# EAGLE design PlantDuino_v2_0 (EAGLE 6.5.0)
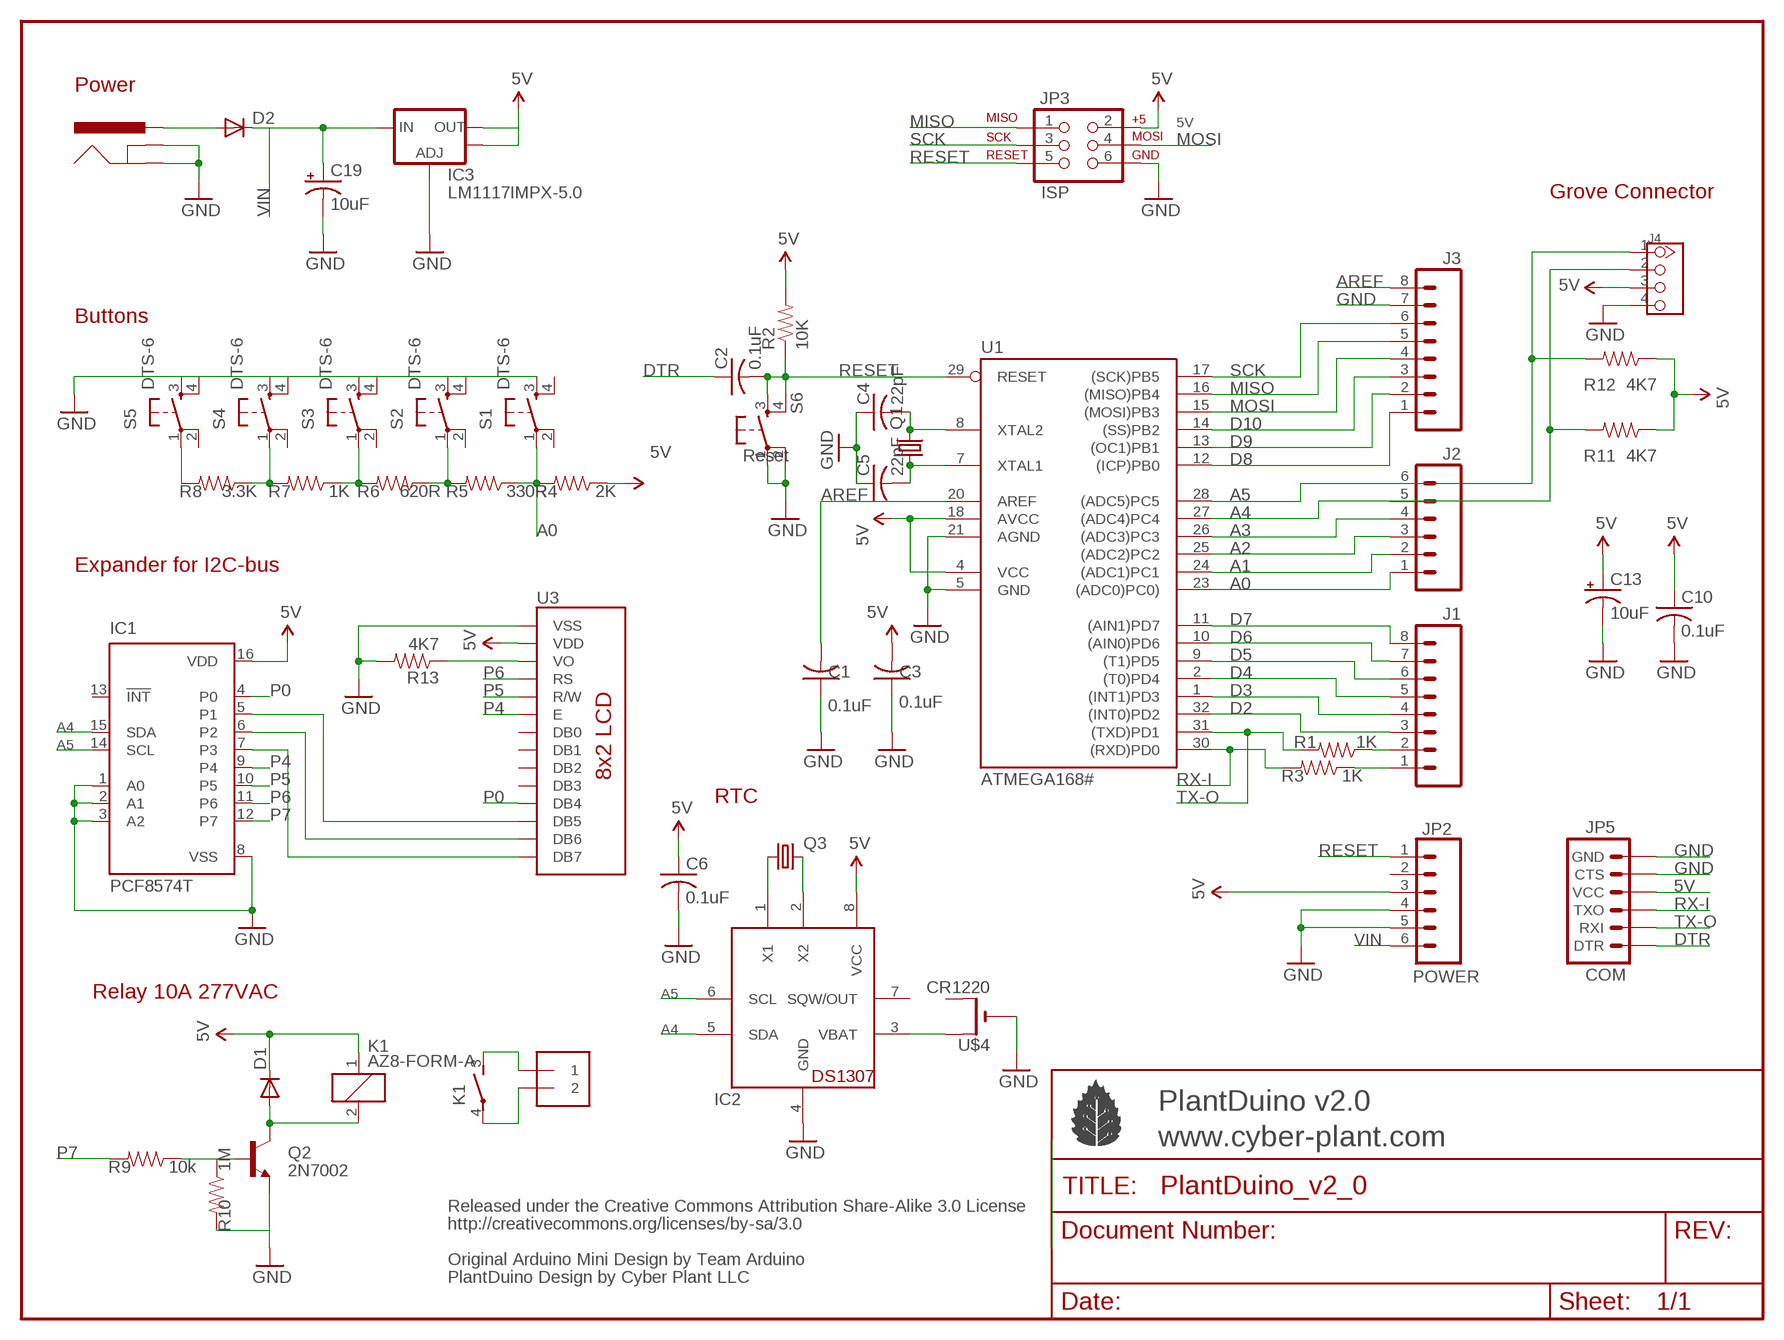
[diagram p0: schematic, sheet 1]

## Parts
C1  0.1uF  C-USC1206  [C1206]
C2  0.1uF  C-USC1206  [C1206]
C3  0.1uF  C-USC1206  [C1206]
C4  22pF  C-USC1206  [C1206]
C5  22pF  C-USC1206  [C1206]
C6  0.1uF  C-USC1206  [C1206]
C10  0.1uF  C-USC1206  [C1206]
C13  10uF  CAP_POL6032  [EIA6032]
C19  10uF  CAP_POL6032  [EIA6032]
D1  DIODESMA  [SMA-DIODE]
D2  DIODESMA  [SMA-DIODE]
IC1  PCF8574T  [SO16W]
IC2  DS1307  [SO08]
IC3  LM1117IMPX-5.0  V_REG_LM1117SOT223  [SOT223]
J1  M08LONGPADS  [1X08_LONGPADS]
J2  M06LONGPADS  [1X06_LONGPADS]
J3  M08LONGPADS  [1X08_LONGPADS]
J4  TWIG-4P-2.090D  [4P-2.0-90D]
JP1  1X2-3.5MM  [1X2-3.5MM]
JP2  POWER  M06LONGPADS  [1X06_LONGPADS]
JP3  ISP  AVR_SPI_PRG_6PTH  [2X3]
JP4  Power Jack  POWER_JACKPTH  [POWER_JACK_PTH]
JP5  COM  ARDUINO_SERIAL_PROGRAMPTH  [1X06]
K1  AZ8-FORM-A  [AZ8]
Q1  CRYTALHC49S  [HC49/S@1]
Q2  2N7002  TRANSISTOR_NPNSOT23  [SOT23]
Q3  CRYSTALTC26H  [TC26H]
R1  1K  RESISTOR1206  [1206]
R2  10K  RESISTOR1206  [1206]
R3  1K  RESISTOR1206  [1206]
R4  2K  RESISTOR1206  [1206]
R5  330R  RESISTOR1206  [1206]
R6  620R  RESISTOR1206  [1206]
R7  1K  RESISTOR1206  [1206]
R8  3.3K  RESISTOR1206  [1206]
R9  10k  RESISTOR1206  [1206]
R10  1M  RESISTOR1206  [1206]
R11  4K7  RESISTOR1206  [1206]
R12  4K7  RESISTOR1206  [1206]
R13  4K7  RESISTOR1206  [1206]
S1  DTS-6  [DTS-6]
S2  DTS-6  [DTS-6]
S3  DTS-6  [DTS-6]
S4  DTS-6  [DTS-6]
S5  DTS-6  [DTS-6]
S6  Reset  DTS-6  [DTS-6]
U1  ATMEGA168#  AT90S4433A  [TQFP32-08]
U3  LCD-8X2-WH0802A8X2  [LCD-8X2-WH0802A]
U$4  CR1220  CR1220THM  [CR1220-THM]

## Nets
5V: C3.2 C6.1 C10.1 C13.P$1(+) D1.C IC1.16(VDD) IC2.8(VCC) IC3.2(OUT) IC3.4(OUT) J4.3 JP2.3 JP3.2 JP5.4(VCC) K1.1 R2.2 R4.1 R11.1 R12.1 U1.4(VCC) U1.18(AVCC) U3.2(VDD)
A0: J2.1 R4.2 R5.1 S1.1 U1.23((ADC0)PC0))
A1: J2.2 U1.24((ADC1)PC1)
A2: J2.3 U1.25((ADC2)PC2)
A3: J2.4 U1.26((ADC3)PC3)
A4: IC1.15(SDA) IC2.5(SDA) J2.5 J4.2 R11.2 U1.27((ADC4)PC4)
A5: IC1.14(SCL) IC2.6(SCL) J2.6 J4.1 R12.2 U1.28((ADC5)PC5)
AREF: C1.2 J3.8 U1.20(AREF)
D2: J1.3 U1.32((INT0)PD2)
D3: J1.4 U1.1((INT1)PD3)
D4: J1.5 U1.2((T0)PD4)
D5: J1.6 U1.9((T1)PD5)
D6: J1.7 U1.10((AIN0)PD6)
D7: J1.8 U1.11((AIN1)PD7)
D8: J3.1 U1.12((ICP)PB0)
D9: J3.2 U1.13((OC1)PB1)
D10: J3.3 U1.14((SS)PB2)
DTR: C2.1 JP5.1(DTR)
GND [vcc]: C1.1 C3.1 C4.1 C5.1 C6.2 C10.2 C13.P$2(-) C19.P$2(-) IC1.1(A0) IC1.2(A1) IC1.3(A2) IC1.8(VSS) IC2.4(GND) IC3.1(ADJ) J3.7 J4.4 JP2.4 JP2.5 JP3.6 JP4.GND JP4.GNDBREAK JP5.5(CTS) JP5.6(GND) Q2.2(E) R10.2 R13.2 S1.3 S2.3 S2.4 S3.3 S3.4 S4.3 S4.4 S5.3 S5.4 S6.1 S6.2 U1.5(GND) U1.21(AGND) U3.1(VSS) U$4.-
MISO: J3.5 JP3.1 U1.16((MISO)PB4)
MOSI: J3.4 JP3.4 U1.15((MOSI)PB3)
N$1: R13.1 U3.3(VO)
N$3: C4.2 Q1.2 U1.8(XTAL2)
N$4: C5.2 Q1.1 U1.7(XTAL1)
N$6: D2.A JP4.PWR
N$8: IC1.7(P3) U3.14(DB7)
N$9: IC1.6(P2) U3.13(DB6)
N$10: IC1.5(P1) U3.12(DB5)
N$12: IC2.3(VBAT) U$4.+1(+)
N$14: JP1.2 K1.4(-1:P)
N$15: JP1.1 K1.3(-1:S)
N$16: Q2.1(B) R9.1 R10.1
N$17: R5.2 R6.1 S2.1
N$18: R6.2 R7.1 S3.1
N$19: R7.2 R8.1 S4.1
N$20: R8.2 S5.1
N$21: IC2.1(X1) Q3.1
N$22: D1.A K1.2 Q2.3(C)
N$24: IC2.2(X2) Q3.2
P0: IC1.4(P0) U3.11(DB4)
P4: IC1.9(P4) U3.6(E)
P5: IC1.10(P5) U3.5(R/W)
P6: IC1.11(P6) U3.4(RS)
P7: IC1.12(P7) R9.2
RESET: C2.2 JP2.1 JP3.5 R2.1 S6.3 S6.4 U1.29(RESET)
RX-I: JP5.3(TXO) R3.2 U1.30((RXD)PD0)
RX-IP: J1.2 R1.1
SCK: J3.6 JP3.3 U1.17((SCK)PB5)
TX-O: JP5.2(RXI) R1.2 U1.31((TXD)PD1)
TX-OP: J1.1 R3.1
VIN [vcc]: C19.P$1(+) D2.C IC3.3(IN) JP2.6
Unconnected: IC1.13(!INT) IC2.7(SQW/OUT) JP2.2 S1.2 S1.4 S2.2 S3.2 S4.2 S5.2 U3.7(DB0) U3.8(DB1) U3.9(DB2) U3.10(DB3) U$4.+2(+1)

## Notes on the sheet
- Power
- Grove Connector
- Buttons
- Expander for I2C-bus
- RTC
- Relay 10A 277VAC
- PlantDuino v2.0
- www.cyber-plant.com
- Released under the Creative Commons Attribution Share-Alike 3.0 License
- http://creativecommons.org/licenses/by-sa/3.0
- Original Arduino Mini Design by Team Arduino
- PlantDuino Design by Cyber Plant LLC

## Library data of the parts
C1-C6 C10 = adafruit:C-US: CAPACITOR, American symbol
C13 C19 = SparkFun:CAP_POL: Capacitor Polarized These are standard SMD and PTH capacitors. Normally 10uF, 47uF, and 100uF in electrolytic and tantalum varieties. Always verify the external diameter of the through hole cap, it varies with capacity, voltage, and manufacturer. The EIA devices should be standard.
D1 D2 = SparkFun:DIODE: Diode These are standard reverse protection diodes and small signal diodes. SMA package can handle up to about 1A. SOD-323 can handle about 200mA. What the SOD-323 package when ordering, there are some mfgs out there that are 5-pin packages.
IC1 = micro-philips:PCF8574: I2C-Bus Remote 8-bit I/O expander http://www.semiconductors.philips.com/acrobat_download/datasheets/PCF8574_4.pdf; MPN: PCF8574T/3,512; OC_FARNELL: 1201255; OC_NEWARK: 70R6870
IC2 = adafruit_ds1307soic8:DS1307: DS1307 Real time clock (RTC) with battery backup ability. Talk to it via i2c
IC3 = SparkFun:V_REG_LM1117: Voltage Regulator LM1117 Standard adjustable voltage regulator but in SMD form. Spark Fun Electronics SKU : COM-00595
J1 J3 = Head_my:M08: Header 8 Standard 8-pin 0.1" header. Use with straight break away headers (SKU : PRT-00116), right angle break away headers (PRT-00553), swiss pins (PRT-00743), machine pins (PRT-00117), and female headers (PRT-00115).
J2 JP2 = Head_my:M06: Header 6 Standard 6-pin 0.1" header. Use with straight break away headers (SKU : PRT-00116), right angle break away headers (PRT-00553), swiss pins (PRT-00743), machine pins (PRT-00117), and female headers (PRT-00115). Molex polarized connector foot print use with SKU : PRT-08094 with associated crimp pins and housings. NOTES ON THE VARIANTS LOCK and LOCK_LONGPADS... This footprint was designed to help hold the alignment of a through-hole component (i.e. 6-pin header) while soldering it into place. You may notice that each hole has been shifted either up or down by 0.005 of an inch from it's more standard position (which is a perfectly straight line). This slight alteration caused the pins (the squares in the middle) to touch the edges of the holes. Because they are alternating, it causes a "brace" to hold the component in place. 0.005 has proven to be the perfect amount of "off-center" position when using our standard breakaway headers. Although looks a little odd when you look at the bare footprint, once you have a header in there, the alteration is very hard to notice. Also, if you push a header all the way into place, it is covered up entirely on the bottom side. This idea of altering the position of holes to aid alignment will be further integrated into the Sparkfun Library for other footprints. It can help hold any component with 3 or more connection pins.
J4 = Connector:TWIG-4P-2.0
JP1 = adafruit:1X2: 3.5mm Terminal block http://www.ladyada.net/library/pcb/eaglelibrary.html
JP3 = SparkFun:AVR_SPI_PRG_6: AVR ISP 6 Pin This is the reduced ISP connector for AVR programming. Common on Arduino. This footprint will take up less PCB space and can be used with a 10-pin to 6-pin adapter such as SKU: BOB-08508
JP4 = SparkFun:POWER_JACK: Power Jack This is the standard 5.5mm barrel jack for power. The PTH is the most common, proven, reliable, footprint. All others are experimental. The Slot footprint only works if the mill layer is transmitted to the PCB fab house so be warned. Spark Fun Electronics SKU : PRT-00119. Mating wall wart : TOL-00298 (and others)
JP5 = SparkFun:ARDUINO_SERIAL_PROGRAM
K1 = relay_my:AZ8-FORM-A: MINIATURE PC BOARD RELAY Form A Source: www.azettler.com .. AZ8-1ch-12DSE.PDF; OC_FARNELL: unknown; OC_NEWARK: unknown
Q1 = crystal:CRYTAL: CRYSTAL
Q2 = SparkFun:TRANSISTOR_NPN: Transistor NPN BJT configuration in SOT23 package. MMBT2222 is the common NPN we use. Double check BCE configuration again layout.
Q3 = crystal:CRYSTAL: CRYSTAL; OC_FARNELL: unknown; OC_NEWARK: unknown
R1-R13 = SparkFun:RESISTOR: Resistor Basic schematic elements and footprints for 0603, 1206, and PTH resistors.
S1-S6 = switch-tact:DTS-6
U1 = atmel:AT90S4433: MICROCONTROLLER 4 Kbytes FLASH 128 bytes SRAM 256 bytes EEPROM UART 6-channel 10 bit ADC
U3 = wh0802a3:LCD-8X2-WH0802A
U$4 = adafruit_ch23-1220lf:CR1220: CR1216/CR1220/CR1225 12mm 3V lithium coin cell Great for battery packup. Both SMT and THM holders. Note the THM package has the ground pads on both sides of the PCB so that the masks are the same - this reduces the cost

## Net classes
0 default: width 0.203 mm
1 vcc: width 0.254 mm

## Board
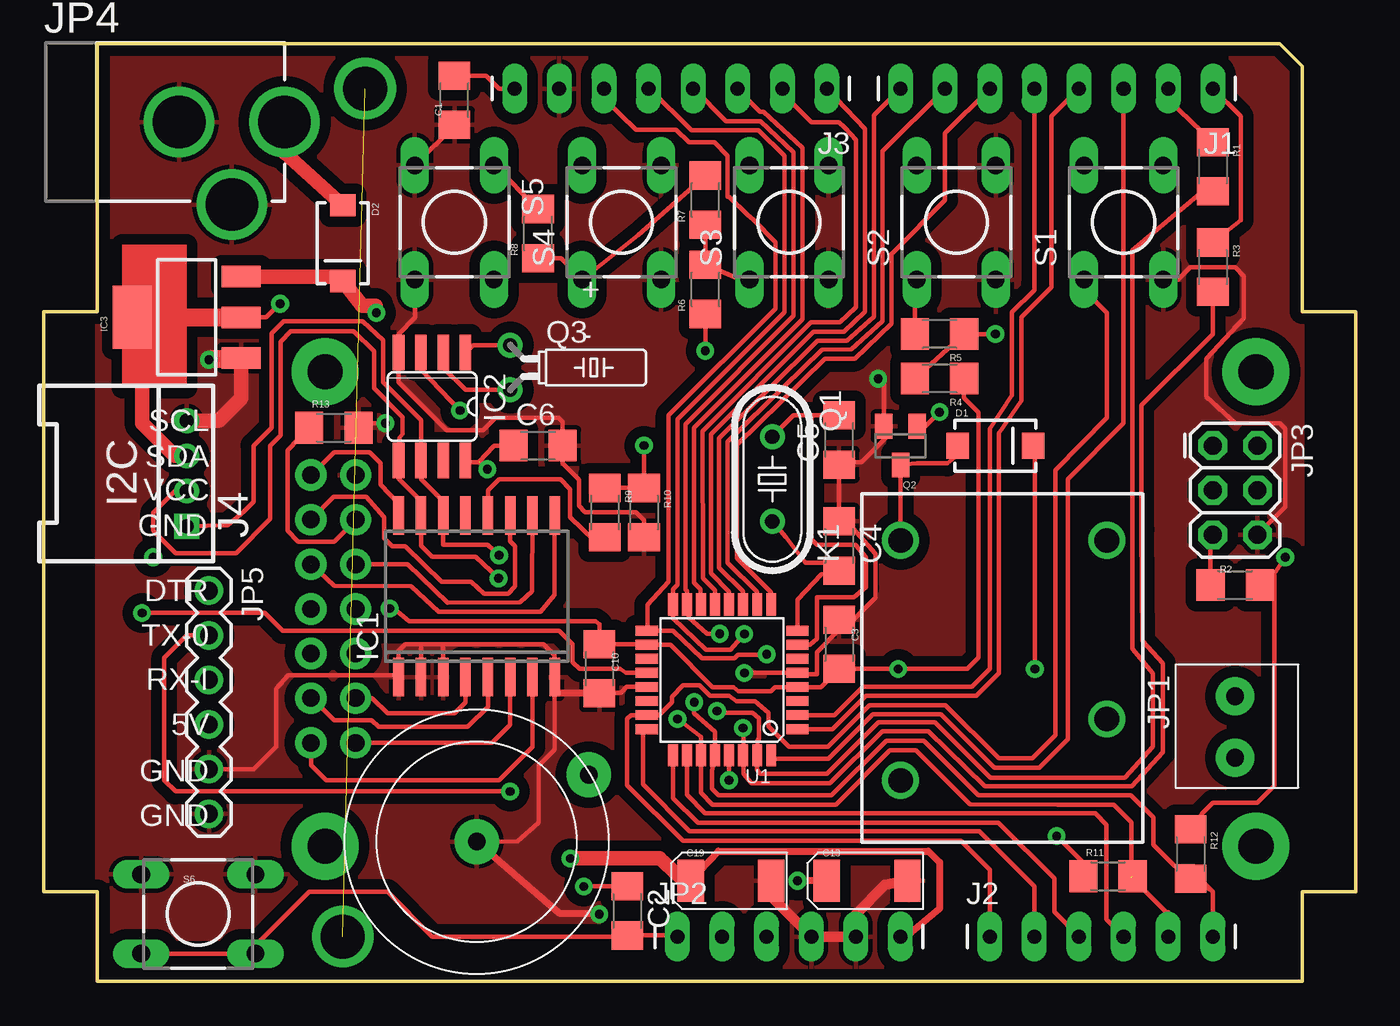
[diagram p1: board, top side]
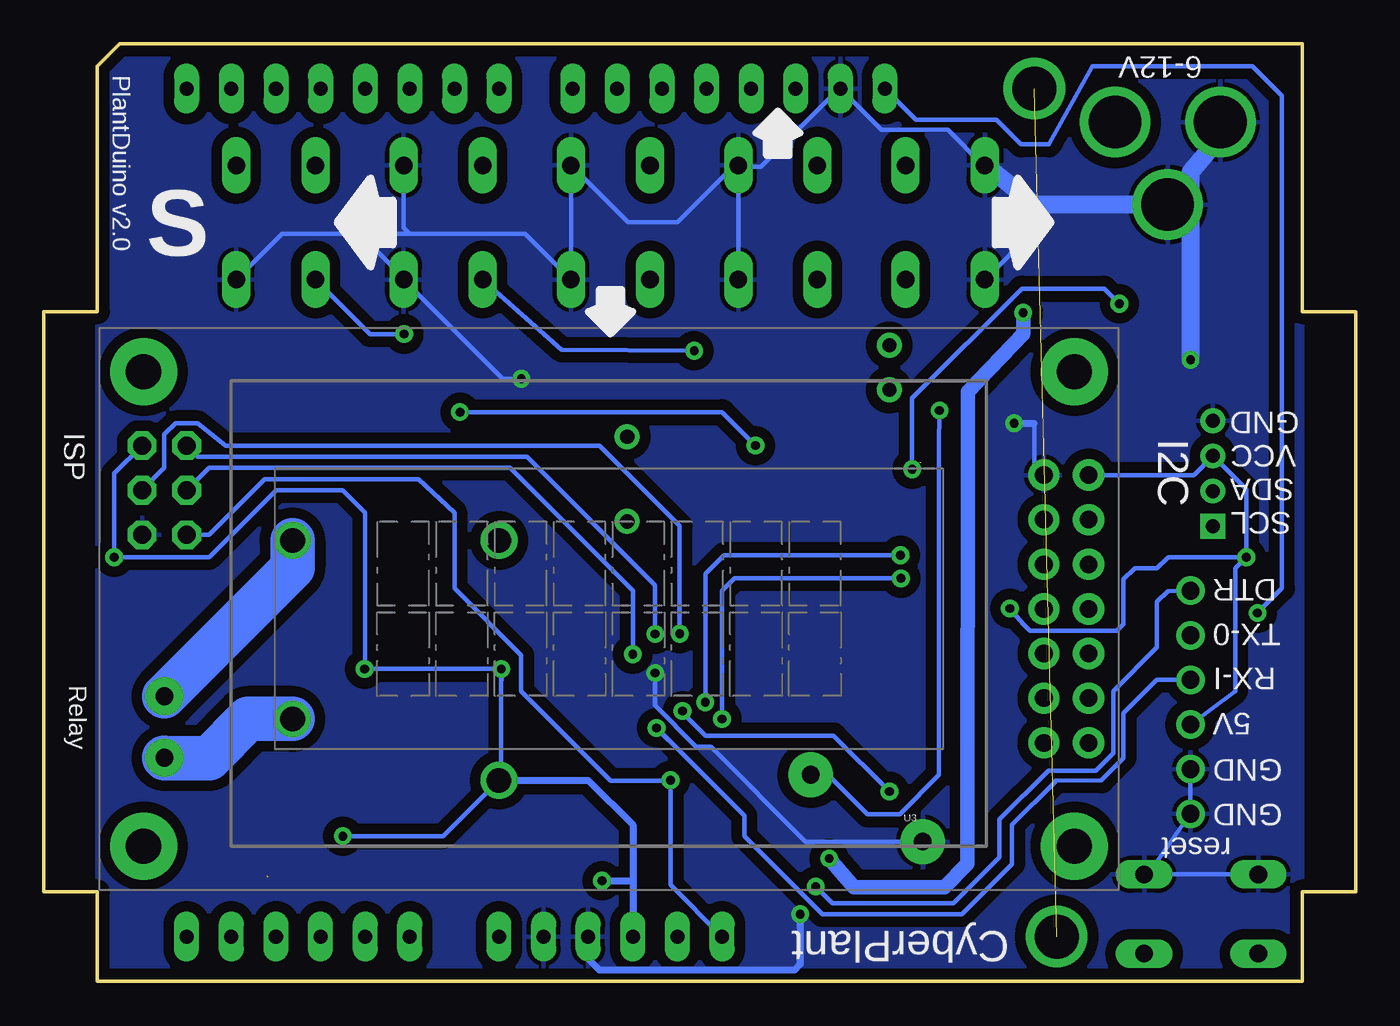
[diagram p2: board, bottom side, seen from below]

Size 74.68 x 53.34 mm. Coordinates in mm from the lower left corner, seen from the top.
Outline: 3.05,53.34 3.05,38.1 0,38.1 0,5.08 3.05,5.08 3.05,0 71.63,0 71.63,5.08 74.68,5.08 74.68,38.1 71.63,38.1 71.63,52.07 70.36,53.34 3.05,53.34
Copper layers (1*16): Top 0.035mm / dielectric 1.5mm / Bottom 0.035mm
Design rules "SparkFun *": minimum track width 8mil, minimum drill 20mil, track to track 10mil, track to pad 10mil, pad to pad 10mil, via to via 10mil, smd to smd 10mil, copper to edge 10mil, drill to drill 8mil, minimum pad ring 12mil, minimum via ring 10mil, stop-mask expansion 4mil, vias tented up to drill 20mil, thermal gap 10mil

### Footprints (pad centres in the part's own frame; a part is rotated, then mirrored left to right if it is on the bottom)
C1206 = smd 1.6 x 1.8: 1 -1.4,0; 2 1.4,0
EIA6032 = smd 1.5 x 2.4: P$1 -2.3,0; P$2 2.3,0
SMA-DIODE = smd 1.27 x 1.47: A -2.15,0; C 2.15,0
SO16W = smd 0.6 x 2.2: 1 -4.445,-4.6; 2 -3.175,-4.6; 3 -1.905,-4.6; 4 -0.635,-4.6; 5 0.635,-4.6; 6 1.905,-4.6; 7 3.175,-4.6; 8 4.445,-4.6; 9 4.445,4.6; 10 3.175,4.6; 11 1.905,4.6; 12 0.635,4.6; 13 -0.635,4.6; 14 -1.905,4.6; 15 -3.175,4.6; 16 -4.445,4.6
SO08 = smd 0.66 x 2.032: 1 -1.905,-3.073; 2 -0.635,-3.073; 3 0.635,-3.073; 4 1.905,-3.073; 5 1.905,3.073; 6 0.635,3.073; 7 -0.635,3.073; 8 -1.905,3.073
SOT223 = smd 1.219 x 2.235: 1 -2.311,-3.099; 2 0,-3.099; 3 2.311,-3.099 | smd 3.6 x 2.2: 4 0,3.099
1X08_LONGPADS = drill 0.8 pad 1.422 long: 1 0,0; 2 2.54,0; 3 5.08,0; 4 7.62,0; 5 10.16,0; 6 12.7,0; 7 15.24,0; 8 17.78,0
1X06_LONGPADS = drill 0.8 pad 1.422 long: 1 0,0; 2 2.54,0; 3 5.08,0; 4 7.62,0; 5 10.16,0; 6 12.7,0
4P-2.0-90D = drill 0.8 pad 1.27 square: 1 -3,0 | drill 0.8 pad 1.27: 2 -1,0; 3 1,0; 4 3,0
1X2-3.5MM = drill 1 pad 2.184: 1 1.8,0; 2 -1.7,0
2X3 = drill 1.016 octagon: 1 0,0; 2 0,2.54; 3 2.54,0; 4 2.54,2.54; 5 5.08,0; 6 5.08,2.54
POWER_JACK_PTH = drill 2.997: GND 0,7.7; GNDBREAK 4.7,10.7; PWR 0,13.7
1X06 = drill 1.016: 1 0,0; 2 2.54,0; 3 5.08,0; 4 7.62,0; 5 10.16,0; 6 12.7,0
AZ8 = drill 1.4 pad 2: 1 4.445,-5.397; 2 -9.207,-5.397; 3 -9.207,6.35; 4 0.953,6.35; 5 0.953,6.35
HC49/S@1 = drill 0.813: 1 -2.413,0; 2 2.413,0
SOT23 = smd 1 x 1.4: 1 -0.95,-1.1; 2 0.95,-1.1; 3 0,1.1
TC26H = drill 0.813: 1 -1.27,0; 2 1.27,0
1206 = smd 1.6 x 1.8: 1 -1.4,0; 2 1.4,0
DTS-6 = drill 1 long: 1 -3.25,2.25; 2 3.25,2.25; 3 -3.25,-2.25; 4 3.25,-2.25
TQFP32-08 = smd 1.27 x 0.559: 1 -4.293,2.8; 2 -4.293,2; 3 -4.293,1.2; 4 -4.293,0.4; 5 -4.293,-0.4; 6 -4.293,-1.2; 7 -4.293,-2; 8 -4.293,-2.8; 17 4.293,-2.8; 18 4.293,-2; 19 4.293,-1.2; 20 4.293,-0.4; 21 4.293,0.4; 22 4.293,1.2; 23 4.293,2; 24 4.293,2.8 | smd 0.559 x 1.27: 9 -2.8,-4.293; 10 -2,-4.293; 11 -1.2,-4.293; 12 -0.4,-4.293; 13 0.4,-4.293; 14 1.2,-4.293; 15 2,-4.293; 16 2.8,-4.293; 25 2.8,4.293; 26 2,4.293; 27 1.2,4.293; 28 0.4,4.293; 29 -0.4,4.293; 30 -1.2,4.293; 31 -2,4.293; 32 -2.8,4.293
LCD-8X2-WH0802A = drill 1 pad 1.778: 1 -26.26,-9.12; 2 -28.8,-9.12; 3 -26.26,-6.58; 4 -28.8,-6.58; 5 -26.26,-4.04; 6 -28.8,-4.04; 7 -26.26,-1.5; 8 -28.8,-1.5; 9 -26.26,1.04; 10 -28.8,1.04; 11 -26.26,3.58; 12 -28.8,3.58; 13 -26.26,6.12; 14 -28.8,6.12 | drill 2 pad 3.81: P$1 -28,-15; P$2 -28,12; P$3 25,12; P$4 25,-15
CR1220-THM = drill 1 pad 2.54: +1 -6.388,-3.81; +2 -6.375,-3.81; - 0,0

### Placement (x,y rotation side)
C1  23.37,50.14 90 top
C2  33.21,4 270 top
C3  45.28,19.18 270 top
C4  45.28,24.77 270 top
C5  45.28,30.8 90 top
C6  28.13,30.48 0 top
C10  31.62,17.78 270 top
C13  46.86,5.71 0 top
C19  39.12,5.71 0 top
D1  54.17,30.48 0 top
D2  17.02,42.01 270 top
IC1  24.64,21.91 0 top
IC2  22.1,32.7 180 top
IC3  8.13,37.78 90 top
J1  66.55,50.8 180 top
J2  53.85,2.54 0 top
J3  44.58,50.8 180 top
J4  8.13,28.89 90 top
JP1  67.82,14.41 90 top
JP2  36.07,2.54 0 top
JP3  66.55,30.48 270 top
JP4  0,48.9 270 top
JP5  9.4,22.23 270 top
K1  54.17,15.88 270 top
Q1  41.47,28.58 270 top
Q2  48.77,30.48 180 top
Q3  26.54,34.92 270 top
R1  66.55,46.35 270 top
R2  67.82,22.54 0 top
R3  66.55,40.64 270 top
R4  50.99,34.29 180 top
R5  50.99,36.83 180 top
R6  37.66,39.37 90 top
R7  37.66,44.45 90 top
R8  28.13,42.55 90 top
R9  31.94,26.67 270 top
R10  34.16,26.67 270 top
R11  60.58,5.97 0 top
R12  65.28,7.24 270 top
R13  16.51,31.5 0 top
S1  61.47,43.18 90 top
S2  51.94,43.18 90 top
S3  42.42,43.18 90 top
S4  32.89,43.18 90 top
S5  23.37,43.18 270 top
S6  8.79,3.82 0 top
U1  38.61,17.15 180 top
U3  44.01,19.69 180 bottom
U$4  24.64,7.94 180 top

### Tracks (layer width: path | path; a pad name or v marks a point on that pad's centre or on a via)
5V  (via drill 0.5)  (1 unrouted)
  Top 0.254: 42.91,16.74 U1.4 | 42.91,16.74 41.63,16.74 41.4,16.51 39.55,16.51 39.27,16.74 38.08,16.74 35.66,19.15 U1.18 34.28,19.18 C10.1 31.62,20.32 31.39,20.5 20.78,20.5 19.94,21.21 v19.68,21.21 | R4.1 52.39,33.21 53.21,32.38 53.21,18.41 52.56,17.77 v48.64,17.77 | R12.1 65.91,9.52 66.55,10.16 69.09,10.16 70.04,11.11 70.04,23.18 | 42.91,16.74 44.24,16.74 C3.2 48,17.78 v48.64,17.77 | 48.61,17.78 v48.64,17.77 | D1.C 56.06,30.23 56.41,29.88 v56.41,17.77 | C6.1 25.64,30.48 24.74,29.53 | 69.22,22.09 R2.2 69.53,22.23 70.04,23.18 | 24,29.46 IC2.8 24.11,29.53 24.8,29.53 v25.25,29.13 | v13.45,38.56 13.41,38.56 12.65,37.8 11.95,37.8 11.94,37.78 | 20.19,27.18 19.18,28.26 19.18,29.46 18.54,30.1 16.51,30.1 U3.2 | 70.04,23.18 v70.67,24.13 | R11.1 59.18,6.73 v57.66,8.25
  Top 0.406: C13.P$1 v42.9,5.71 | 20.19,27.18 IC1.16
  Top 0.61: IC3.2 11.94,37.78 7.81,37.72
  Top 0.813: J4.3 7.45,29.89 5.59,31.75 5.59,37.78
  Top 1.016: IC3.4 5.59,37.78 IC3.2
  Bottom 0.254: v48.64,17.77 48.62,17.13 48.65,17.15 48.62,17.77 v48.64,17.77 | JP3.2 70.67,28.89 v70.67,24.13 65.28,24.13 61.47,27.94 57.66,27.94 56.39,26.67 56.39,17.79 | JP5.4 6.86,16.51 6.86,23.49 v6.22,24.13 | v19.68,21.21 18.92,20.32 18.54,19.94 13.59,19.94 13.21,20.32 13.21,22.86 12.57,23.49 11.3,23.49 10.67,24.13 v6.22,24.13 | v25.25,29.13 25.25,33.17 19,39.42 14.31,39.42 v13.45,38.56 | v48.64,17.77 48.64,11.24 K1.1 51.94,8.25 v57.66,8.25 | 56.39,17.79 v56.41,17.77 | 56.39,17.79 48.67,17.79 v48.64,17.77 | v6.22,24.13 6.22,27.99 J4.3 9.21,28.8 U3.2
  Bottom 0.406: K1.1 43.69,11.43 41.15,8.89 41.15,5.71 | 41.15,5.71 JP2.3 | v42.9,5.71 41.15,5.71
A0  (via drill 0.5)
  Top 0.254: J2.1 53.85,6.35 52.23,7.96 52.21,7.99 36.39,7.99 33.21,11.16 33.21,14.92 33.43,15.15 U1.23 35.02,15.15 35.75,15.88 35.75,16.19 36.39,16.83 37.34,16.83 37.91,16.26 39.01,16.26 39.42,15.93 40.49,15.93 41.25,15.27 41.25,14.5 42.42,13.34 44.63,13.34 46.99,15.7 51.33,15.7 54.36,12.67 56.27,12.67 57.59,14 57.59,29.08 60.52,32.07 60.52,38.05 58.93,39.64 S1.1 | R4.2 R5.1 v54.17,36.83
  Bottom 0.254: v54.17,36.83 56.12,36.83 S1.1
A1
  Top 0.254: U1.24 34.11,14.34 34.11,12.12 34.11,11.2 36.75,8.53 53.25,8.53 56.39,5.4 J2.2
A2
  Top 0.254: 58.93,2.79 J2.3 57.52,3.95 57.52,5.86 54.34,9.03 37.23,9.03 35.81,10.41 35.81,11.05 U1.25
A3
  Top 0.254: U1.26 36.61,10.66 36.61,10.6 37.62,9.55 59.86,9.55 60.49,8.91 60.49,3.52 J2.4
A4  (via drill 0.5)  (1 unrouted)
  Top 0.254: J2.5 64.01,3.81 | 64.01,3.81 64.01,3.93 | 62.1,6.1 R11.2 62.23,6.03 61.78,6.35 | v25.88,22.92 24.59,24.16 22.1,24.16 21.46,24.79 IC1.15 21.46,27.32 20.19,28.59 20.24,28.64 20.24,29.58 | v36.07,14.92 37.41,13.9 U1.27 37.41,10.73 38.06,10.05 45.1,10.05 48.16,13.13 49.66,13.13 52.73,10.06 57.69,10.05 60.9,10.05 61.9,9.05 61.9,5.92 64.01,3.81 | J4.2 7.49,27.94 6.22,26.67 6.22,25.63 7.49,24.37 10.95,24.37 12.89,26.3 12.89,30.48 13.49,31.08 13.49,36.39 13.51,36.41 14.05,36.99 17.64,36.98 18.81,35.85 18.81,33.76 18.81,33.73 20.43,32.11 20.42,31.17 20.24,30.94 20.24,29.58 | 20.24,29.58 IC2.5
  Bottom 0.254: v25.88,22.92 35.37,22.92 36.07,22.23 v36.07,14.92
A5  (via drill 0.5)
  Top 0.254: J2.6 66.55,5.08 | 66.55,5.08 66.04,5.61 65.91,5.66 65.91,6.1 65.51,6.53 64.39,6.54 63.16,7.77 63.16,9.32 61.89,10.59 53.21,10.59 50.11,13.69 47.95,13.69 44.84,10.58 38.39,10.58 38.03,10.94 38.02,10.94 38.02,11.99 U1.28 38.21,14.2 37.02,15.24 v37.02,15.88 | v25.91,24.24 25.25,24.84 22.73,24.84 IC1.14 22.73,27.3 21.46,28.58 21.46,28.7 IC2.6 21.46,31.93 19.3,34.09 19.3,36.47 18.14,37.57 13.64,37.57 12.96,36.88 12.96,31.5 11.94,30.48 11.94,27.29 11.4,26.76 10.45,25.95 J4.1 | R12.2 66.42,5.2 66.55,5.08
  Bottom 0.254: v25.91,24.24 35.95,24.24 37.02,23.18 v37.02,15.88
AREF  (via drill 0.5)
  Top 0.254: C1.2 25.17,51.54 25.91,50.8 J3.8 | U1.20 33.13,17.55 32.79,17.78 30.5,17.78 30.1,18.16 30.1,19.18 29.34,19.94 13.59,19.94 12.57,20.95 v5.59,20.95
  Bottom 0.254: 26.86,50.8 J3.8 25.02,49.02 20.45,49.02 19.05,47.62 17.46,47.62 14.99,52.07 5.87,52.07 4.19,50.39 4.19,22.35 v5.59,20.95
D2
  Top 0.254: U1.32 41.41,12.45 41.4,12.45 41.75,12.66 44.67,12.66 47.19,15.19 51.05,15.19 54.1,12.14 56.67,12.14 58.29,13.77 58.29,28.58 61.47,31.75 J1.3
D3
  Top 0.254: U1.1 44.89,14.34 46.8,16.26 53.09,16.26 54.36,17.53 54.36,31.18 55.65,33.03 55.65,37.78 57.37,39.48 57.37,49.24 J1.4
D4
  Top 0.254: 56.39,39.33 55.12,38.06 55.12,33.34 53.85,31.43 53.85,17.78 52.83,16.76 46.62,16.76 45,15.15 U1.2 | 56.39,39.33 56.38,39.7 | J1.5 56.39,39.33
D5
  Top 0.254: 41.4,21.34 U1.9 41.4,22.12 39.45,24.08 39.45,30.53 44.47,35.43 46.17,35.43 48.26,37.4 48.26,41.39 48.32,41.46 51.31,44.45 51.31,48.26 J1.6 53.72,50.8
D6
  Top 0.254: 40.64,21.59 40.61,21.56 U1.10 40.59,21.46 40.59,22.15 38.92,23.81 38.92,30.7 44.3,35.94 45.99,35.95 47.74,37.55 47.75,47.24 51.28,50.75 J1.7
D7
  Top 0.254: U1.11 39.81,22.18 38.44,23.53 38.44,30.91 44.04,36.45 45.72,36.45 47.24,37.81 47.24,49.28 J1.8
D8
  Top 0.254: U1.12 39.01,22.16 37.97,23.23 37.97,31.12 43.81,36.96 45.54,36.96 46.74,38.09 46.74,48.5 J3.1
D9
  Top 0.254: J3.2 42.04,50.55 43.69,48.9 45.28,48.9 45.59,48.58 46.23,47.88 46.23,38.34 45.33,37.49 43.69,37.49 43.67,37.5 37.5,31.31 37.51,23.11 37.51,22.94 38.2,22.25 U1.13
D10
  Top 0.254: J3.3 40.77,49.49 40.96,49.49 43.18,47.43 43.18,37.67 37.02,31.51 37.02,22.67 37.39,22.3 37.39,21.46 U1.14 37.43,21.46 37.47,21.46
DTR  (via drill 0.5)
  Top 0.254: C2.1 30.75,5.4 v30.73,5.38
  Bottom 0.254: v30.73,5.38 30.71,5.38 29.77,4.45 22.89,4.45 20.27,7.06 20.27,9.22 17.5,11.99 14.78,11.99 13.79,12.98 13.79,16.51 11.3,19 11.3,21.59 10.69,22.2 JP5.1
GND  (via drill 0.5)
  Top 0.254: U1.21 33.18,16.74 32.84,16.41 29.14,16.41 29.08,16.19 IC1.8 29.08,18.54 28.45,19.18 22.61,19.18 | 30.99,17.02 31.24,16.76 C10.2 29.06,16.41 29.06,13.18 28.17,12.27 28.17,9.02 26.97,7.95 U$4.- | v47.5,34.29 47.82,33.97 Q2.2 48.14,31.12 46.55,29.53 45.41,29.53 C5.1 C4.1 45.78,25.78 46.05,25.78 47.35,24.32 47.35,21.81 46.03,20.52 46.03,19.94 C3.1 45.28,20 44.01,18.73 44.01,17.46 42.98,17.46 U1.5 39.96,17.55 v39.88,17.54 | S5.4 21.15,39.9 21.15,37.78 20.19,36.83 IC2.4 20.19,34.09 22.94,31.34 24.99,31.34 25.71,32.05 29.31,32.05 29.54,31.83 29.54,30.49 C6.2 29.53,29.47 30.46,28.55 30.46,27.05 30.81,26.7 33.71,26.7 34.16,26.24 R10.2 | R13.2 17.91,31.75 v19.44,31.75 | S1.3 64.57,39.93 65.28,40.64 67.82,40.64 68.33,40.13 68.33,37.72 66.17,35.43 66.17,33.27 67.82,31.75 70.36,31.75 70.67,31.43 70.67,26.99 JP3.6 | C1.1 23.37,48.68 S5.3 | 21.46,19.18 20.57,19.18 20.19,18.8 IC1.1 20.19,17.4 13.9,17.41 13.21,16.64 13.21,13.34 11.94,12.06 JP5.5 | 21.46,19.18 22.61,19.18 | IC1.2 21.46,19.18 | IC1.3 22.73,19.05 22.61,19.18
  Top 0.406: U$4.- 29.32,3.87 31.56,3.87 v31.62,3.81 | 29.14,16.41 31.22,16.41 31.24,16.76
  Top 0.61: C13.P$2 47.89,5.48 46.23,3.81 JP2.5 JP2.4 41.1,5.13 C19.P$2
  Top 0.813: 11.3,35.4 IC3.1 11.23,33.16 9.96,31.89 J4.4
  Top 1.016: 11.3,35.4 9.52,35.4 v9.4,35.37
  Bottom 0.254: S5.3 21.22,46.43 23.2,48.46 27,48.46 J3.7 | 18.25,44.2 18.25,42.8 S5.4 | 56.7,42.55 54.19,40.03 S2.3 48.55,34.29 v47.5,34.29 | 56.7,42.55 61.1,42.55 S1.3 | 56.7,42.55 53.85,42.55 | 53.85,42.55 47.28,42.55 S3.3 S3.4 41.42,43.18 38.61,43.18 35.36,46.43 S4.4 | v39.88,17.54 39.88,15.7 37.54,13.34 36.7,13.34 31.3,7.94 U$4.- | S2.4 54.19,42.89 53.85,42.55 | 29.4,50.8 33.84,46.35 35.07,46.35 S4.4 | S4.4 S4.3 | 18.29,31.75 18.29,29.35 U3.1 | JP5.5 JP5.6 11.3,6.81 S6.2 S6.1
  Bottom 0.406: v19.44,31.75 18.29,31.75 | v31.62,3.81 31.62,0.95 31.94,0.63 43.05,0.63 43.69,1.27 JP2.4
  Bottom 1.016: S5.3 18.25,44.2 JP4.GNDBREAK 9.65,44.2 9.4,44.45 | JP4.GND 7.7,48.05 9.4,46.04 9.4,44.45 | 9.4,44.45 v9.4,35.37
  pour Top (isolate 0.61): 3.05,53.34 71.63,53.34 71.63,0 3.05,0
  pour Bottom (isolate 0.61): 3.05,53.34 71.63,53.34 71.63,0 3.05,0
MISO  (via drill 0.5)
  Top 0.254: J3.5 34.48,50.8 36.87,48.43 40.68,48.43 42.16,46.99 42.16,38.08 36.07,31.98 36.08,22.68 36.08,22.57 35.81,22.3 U1.16 | U1.16 35.81,21.34 35.81,20.65 37.69,18.86 39.09,18.86 v39.88,19.76 | 35.94,21.34 35.84,21.44 U1.16
  Bottom 0.254: JP3.1 65.91,29.84 47.18,29.84 39.88,22.54 v39.88,19.76
MOSI  (via drill 0.5)
  Top 0.254: J3.4 37.02,50.8 38.82,48.95 40.79,48.95 42.67,47.18 42.67,37.87 36.54,31.7 36.54,22.29 36.6,22.23 U1.15 | 36.58,21.34 36.58,21.41 U1.15 | v38.48,19.77 37.74,19.77 36.7,20.7 36.7,21.21 36.58,21.34 | 36.58,21.34 36.61,21.37 U1.15 | 36.7,21.46 36.68,21.44 U1.15
  Bottom 0.254: JP3.4 67.82,29.21 67.82,31.12 67.18,31.75 65.91,31.75 64.33,30.48 43.05,30.48 38.48,25.91 v38.48,19.77
N$1
  Top 0.254: U3.3 17.75,26.26 16.51,25.02 14.48,25.02 13.87,25.63 13.87,30.2 R13.1
N$3
  Top 0.254: U1.8 42.9,21.72 44.25,23.17 45.47,23.18 45.59,23.18 C4.2 45.41,23.81 43.37,23.81 42.25,25.26 Q1.2
N$4
  Top 0.254: U1.7 43.62,19.15 44.01,19.5 44.01,21.84 46.11,21.84 46.81,22.42 46.81,24.13 46.19,24.83 44.01,24.83 43.69,25.15 43.69,32.07 43.82,32.2 C5.2 42.66,32.2 41.58,31.12 Q1.1
N$6
  Top 0.813: JP4.PWR 13.7,47.15 D2.A
N$8
  Top 0.254: IC1.7 27.81,13.34 25.91,11.43 16.07,11.43 15.21,12.29 U3.14
N$9
  Top 0.254: U3.13 25.5,13.56 26.54,14.6 IC1.6
N$10
  Top 0.254: U3.12 15.26,16.1 16.51,14.86 18.67,14.86 19.05,14.48 24.13,14.48 25.27,15.62 IC1.5
N$12  (via drill 0.5)
  Top 0.254: v23.69,32.47 21.46,34.8 IC2.3
  Bottom 0.254: U$4.+1 30.04,11.75 27.79,9.5 25.93,9.5 23.72,11.73 23.71,30.39 v23.69,32.47
N$13  (via drill 2.5)  (1 unrouted)
  other vias: 17.02,2.54 18.29,50.8
N$14
  Bottom 2.54: K1.4 63.06,14.92 65.28,12.7 67.8,12.7 JP1.2
N$15
  Bottom 2.54: K1.3 60.52,23.52 JP1.1
N$16  (via drill 0.5)
  Top 0.254: Q2.1 50.19,31.58 v50.99,32.38 | v34.16,30.48 R10.1 R9.1
  Bottom 0.254: v50.99,32.38 36.07,32.38 v34.16,30.48
N$17  (via drill 0.5)
  Top 0.254: R6.1 v37.66,35.88 | R5.2 49.59,39.83 S2.1
  Bottom 0.254: v37.66,35.88 45.2,35.94 S2.1
N$18
  Top 0.254: S3.1 39.67,39.93 R6.2 R7.1
N$19
  Top 0.254: R8.1 29.43,41.15 S4.1 33.82,42.44 R7.2
N$20
  Top 0.254: S5.1 25.65,46.43 R8.2
N$21
  Top 0.254: Q3.1 24.42,36.2 IC2.1
N$22
  Top 0.254: D1.A 52.02,29.92 51.44,29.46 49.7,29.46 Q2.3 K1.2
N$24
  Top 0.254: IC2.2 22.73,34.92 24,33.66 Q3.2
P0
  Top 0.254: IC1.4 24,15.88 23.37,15.24 19.56,15.24 18.69,16.1 U3.11
P4  (1 unrouted)
  Top 0.254: U3.6 16.51,22.49 20.9,22.47 22.47,21.02 28.27,21.02 29.08,21.98 IC1.9
P5
  Top 0.254: IC1.10 27.8,22.2 27.1,21.55 22.97,21.54 20.71,23.73 U3.5
P6
  Top 0.254: IC1.11 26.54,25.04 26.82,24.77 26.82,22.48 26.42,22.05 25.06,22.05 24.33,22.73 22.64,22.73 20.57,24.77 19.81,24.77 19.37,25.21 19.37,26.42 18.35,27.56 16.5,27.56 U3.4
P7
  Top 0.254: IC1.12 25.27,27.94 25.91,28.58 29.4,28.58 29.95,28 29.95,26.42 31.3,25.08 31.75,25.08 R9.2
RESET  (via drill 0.5)
  Top 0.254: U1.29 v39.01,11.44 | S6.3 S6.4 12.04,2 15.11,5.08 19.56,5.08 22.1,2.54 33.15,2.54 C2.2 36.01,2.6 JP2.1 | JP3.5 66.42,25.27 R2.1 66.42,22.99
  Bottom 0.254: JP2.1 39.01,5.48 v39.01,11.44 38.99,11.41 42.43,11.41 47.5,16.51 47.5,18.54 51.31,22.35 51.31,26.67 53.34,28.58 62.1,28.58 65.28,25.4 JP3.5
RX-I  (via drill 0.5)
  Top 0.254: R3.2 66.55,36.83 62.48,32.77 62.48,25.72 62.52,19.37 63.69,18.1 63.69,13.02 61.92,11.1 53.57,11.1 50.34,14.22 47.73,14.22 44.75,11.25 40.28,11.25 39.82,11.82 39.82,11.96 U1.30 39.88,12.78 39.75,12.83 39.81,13.53 v39.8,14.41
  Bottom 0.254: JP5.3 11.3,17.15 13.21,15.24 13.21,12.69 14.47,11.42 17.09,11.41 17.09,11.35 19.56,8.89 19.56,6.67 22.42,3.81 30.35,3.81 34.8,8.25 34.8,9.41 v39.8,14.41 39.12,13.72
RX-IP
  Top 0.254: R1.1 64.01,50.16 J1.2
SCK  (via drill 0.5)
  Top 0.254: J3.6 31.88,50.23 33.72,48.45 35.99,48.46 36.73,47.75 38.19,47.75 38.92,46.99 38.92,44.64 38.99,44.64 40.07,43.62 40.39,43.32 41.66,42.05 41.66,38.28 35.56,32.22 35.57,22.75 34.35,21.42 34.35,20.19 U1.17 35.81,19.95 37.48,18.36 39.32,18.36 39.52,18.57 40.61,18.57 41.12,18.59 41.15,18.59 v41.15,18.6
  Bottom 0.254: JP3.3 65.28,29.21 48.13,29.21 41.15,22.23 v41.15,18.6
TX-O  (via drill 0.5)
  Top 0.254: v26.54,10.79 7.49,10.79 6.86,11.43 6.86,18.41 8.13,19.69 JP5.2 | R1.2 65.97,44.96 61.98,41.59 61.98,18.92 63.14,17.53 63.14,13.34 61.54,11.58 53.87,11.58 50.72,14.73 47.5,14.73 44.58,11.81 40.8,11.81 40.61,12.02 U1.31 40.61,13.66 40.71,13.85 40.71,14.95 40.33,15.28 38.32,15.28 v38.32,15.38
  Bottom 0.254: v26.54,10.79 29.72,13.97 37.02,13.97 | 37.02,13.97 37.02,13.98 | v38.32,15.38 38.32,15.27 37.02,13.97
TX-OP
  Top 0.254: R3.1 68.14,43.31 68.14,49.21 J1.1
VIN  (via drill 0.5)
  Top 0.406: C19.P$1 38.41,7.4 50.36,7.4 50.99,6.77 50.99,4.13 49.09,2.54 JP2.6
  Top 0.813: v18.92,38.04 18.9,38.04 18.9,38.25 18.87,38.25 18.87,38.43 18.12,38.43 D2.C 16.7,40.09 IC3.3 | v29.97,6.98 35.05,6.98 36.45,5.71 C19.P$1
  Bottom 0.813: v18.92,38.04 18.92,36.85 22.07,33.55 22.1,6.68 23.42,5.36 28.55,5.36 v29.97,6.98
(copper drawn outside any net)
  shapes: Top area x1

### Text on the board
tPlace: + | - | SCL | SDA | I2C | VCC | GND | DTR | TX-0 | RX-I | 5V | GND | GND
bPlace: 6-12V | PlantDuino v2.0 | S | GND | ISP | VCC | I2C | SDA | SCL | DTR | TX-0 | RX-I | Relay | 5V | GND | GND | reset | CyberPlant
tValues: DNP | DNP | Production: DNP | DNP | JST-Right Angle | Production: DNP | Proto: 2x3 male header up | DNP | DNP | DNP | DNP